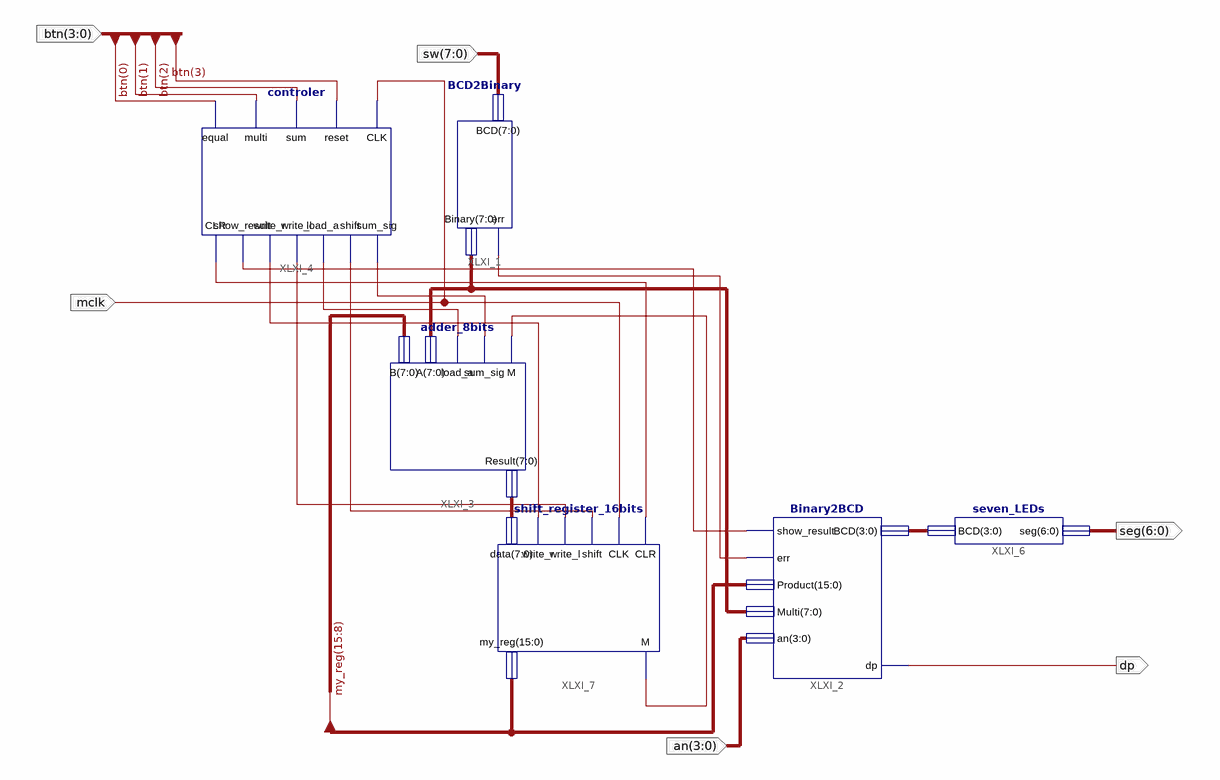
[diagram p0: schematic sheet 1]
// Xilinx ISE schematic calc.sch (spartan3e) as structural Verilog: 6 symbols, 6 ports
module calc (
  input  [3:0] btn,
  input  mclk,
  input  [3:0] an,
  input  [7:0] sw,
  output [6:0] seg,
  output dp
);

  wire XLXN_13, XLXN_14, XLXN_15, XLXN_16, XLXN_17, XLXN_26, XLXN_27, XLXN_28, XLXN_29;
  wire [3:0] XLXN_25;
  wire [7:0] XLXN_18, XLXN_30;
  wire [15:0] my_reg;

  BCD2Binary XLXI_1 (.BCD(sw), .err(XLXN_13), .Binary(XLXN_18));
  Binary2BCD XLXI_2 (
    .show_result(XLXN_14), .err(XLXN_13), .Product(my_reg), .Multi(XLXN_18), .an(an), .dp(dp), .BCD(XLXN_25));
  adder_8bits XLXI_3 (
    .M(XLXN_17), .sum_sig(XLXN_16), .load_a(XLXN_15), .A(XLXN_18), .B(my_reg[15:8]), .Result(XLXN_30));
  controler XLXI_4 (
    .CLK(mclk), .reset(btn[3]), .sum(btn[2]), .multi(btn[1]), .equal(btn[0]), .sum_sig(XLXN_16),
    .shift(XLXN_29), .load_a(XLXN_15), .write_l(XLXN_28), .write_r(XLXN_27), .show_result(XLXN_14),
    .CLR(XLXN_26));
  seven_LEDs XLXI_6 (.BCD(XLXN_25), .seg(seg));
  shift_register_16bits XLXI_7 (
    .CLR(XLXN_26), .CLK(mclk), .shift(XLXN_29), .write_l(XLXN_28), .write_r(XLXN_27), .data(XLXN_30),
    .M(XLXN_17), .my_reg(my_reg));
endmodule
